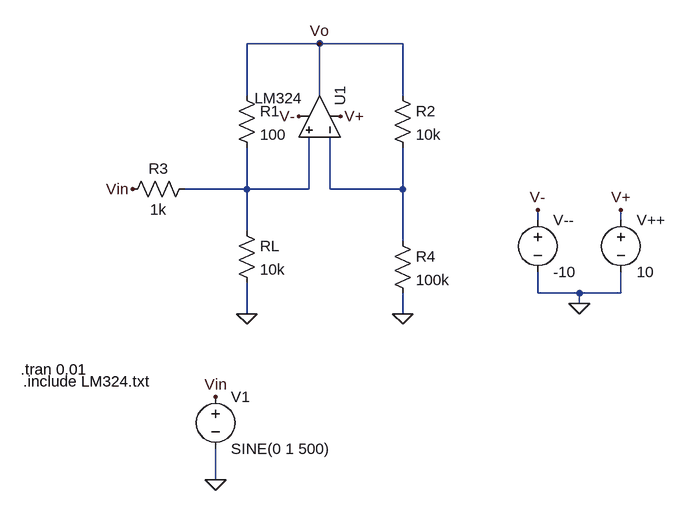
[diagram p0: schematic Lab1Circ2.asc]
Lab1Circ2.asc, the LTspice schematic file:
Version 4
SHEET 1 1424 680
WIRE 448 -176 336 -176
WIRE 576 -176 448 -176
WIRE 336 -96 336 -176
WIRE 448 -96 448 -176
WIRE 576 -96 576 -176
WIRE 336 48 336 -16
WIRE 336 48 240 48
WIRE 432 48 432 -32
WIRE 432 48 336 48
WIRE 464 48 464 -32
WIRE 576 48 576 -16
WIRE 576 48 464 48
WIRE 784 96 784 80
WIRE 912 96 912 80
WIRE 336 112 336 48
WIRE 576 128 576 48
WIRE 784 208 784 176
WIRE 848 208 784 208
WIRE 912 208 912 176
WIRE 912 208 848 208
WIRE 848 224 848 208
WIRE 336 240 336 192
WIRE 576 240 576 208
WIRE 288 496 288 448
FLAG 848 224 0
FLAG 336 240 0
FLAG 912 80 V+
FLAG 480 -64 V+
FLAG 784 80 V-
FLAG 416 -64 V-
FLAG 448 -176 Vo
FLAG 288 496 0
FLAG 288 368 Vin
FLAG 160 48 Vin
FLAG 576 240 0
SYMBOL AutoGenerated\\LM324 512 -64 M270
WINDOW 3 28 90 VRight 2
SYMATTR InstName U1
SYMBOL voltage 912 80 R0
WINDOW 123 0 0 Left 0
WINDOW 39 24 124 Left 2
SYMATTR InstName V++
SYMATTR Value 10
SYMBOL voltage 784 80 R0
WINDOW 123 0 0 Left 0
WINDOW 39 24 124 Left 2
SYMATTR InstName V--
SYMATTR Value -10
SYMBOL res 320 96 R0
SYMATTR InstName RL
SYMATTR Value 10k
SYMBOL res 320 -112 R0
SYMATTR InstName R1
SYMATTR Value 100
SYMBOL voltage 288 352 R0
WINDOW 123 24 124 Left 2
WINDOW 39 24 124 Left 2
SYMATTR InstName V1
SYMATTR Value SINE(0 1 500)
SYMBOL res 256 32 R90
WINDOW 0 0 56 VBottom 2
WINDOW 3 32 56 VTop 2
SYMATTR InstName R3
SYMATTR Value 1k
SYMBOL res 560 -112 R0
SYMATTR InstName R2
SYMATTR Value 10k
SYMBOL res 560 112 R0
SYMATTR InstName R4
SYMATTR Value 100k
TEXT -12 326 Left 2 !.tran 0.01
TEXT -8 344 Left 2 !.include LM324.txt

The netlist it stands for:
* Lab1Circ2.asc
* U1: LM324 (symbol AutoGenerated\LM324 not available, pins judged from their places): In+=N001 In-=N002 V+=V+ V-=V- OUT=Vo
V++ V+ 0 10
V-- V- 0 -10
RL N001 0 10k
R1 Vo N001 100
V1 Vin 0 SINE(0 1 500)
R3 N001 Vin 1k
R2 Vo N002 10k
R4 N002 0 100k
.tran 0.01
.include LM324.txt
.backanno
.end